# Altium schematic sheet MCU.SchDoc
size A4
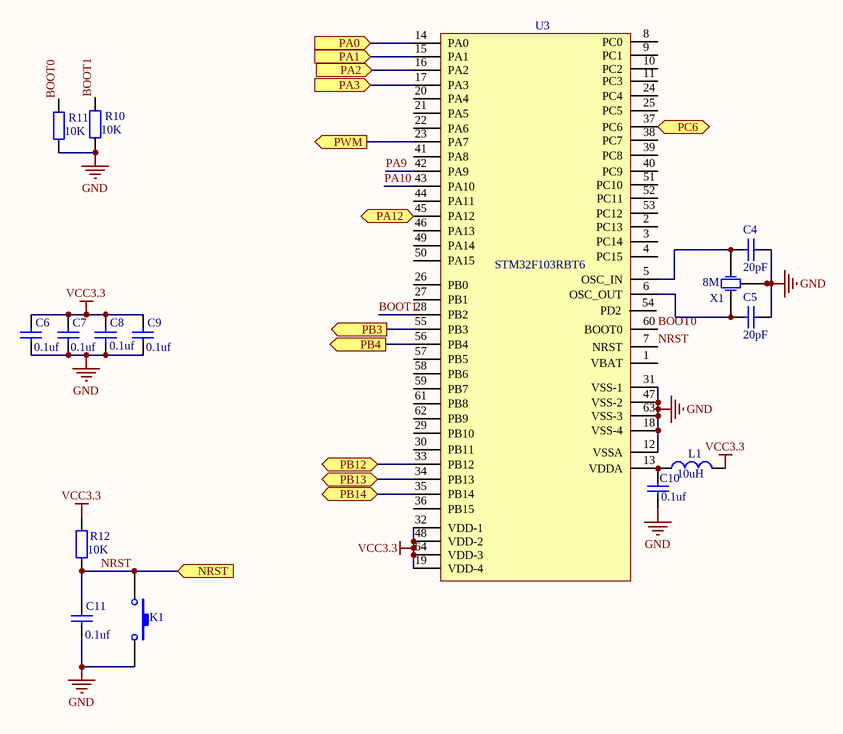
[diagram p0: MCU.SchDoc]

## Parts
C4  value 20pF  [0603]  (hidden comment: Capacitor-0805)
C5  value 20pF  [0603]  (hidden comment: Capacitor-0805)
C6  value 0.1uf  [0603]  (hidden comment: Capacitor-0603)
C7  value 0.1uf  [0603]  (hidden comment: Capacitor-0603)
C8  value 0.1uf  [0603]  (hidden comment: Capacitor-0603)
C9  value 0.1uf  [0603]  (hidden comment: Capacitor-0603)
C10  value 0.1uf  [0603]  (hidden comment: Capacitor-0603)
C11  value 0.1uf  [0603]  (hidden comment: Capacitor-0603)
K1  按键  [mini按键]  (value not drawn)
L1  value 10uH  [0805]  (hidden comment: Inductor)
R10  value 10K  [0603]  (hidden comment: Resistor-0603)
R11  value 10K  [0603]  (hidden comment: Resistor-0603)
R12  value 10K  [0603]  (hidden comment: Resistor-0603)
U3  STM32F103RBT6  [STM32F103RBT6]
X1  value 8M  [3225无源晶振]  (hidden comment: 3225无源晶振)

## Ports
NRST (in), PA0 (in), PA1 (in), PA2 (in), PA3 (in), PA12, PB3 (out), PB4 (out), PB12, PB13, PB14, PC6, PWM (out)

## Nets
GND: C4.1 C5.1 C6.1 C7.1 C8.1 C9.1 C10.1 C11.1 K1.2 R10.1 R11.1 U3.12(VSSA) U3.18(VSS-4) U3.31(VSS-1) U3.47(VSS-2) U3.63(VSS-3) X1.2(GND) X1.4(GND)
VCC3.3: C6.2 C7.2 C8.2 C9.2 L1.2 R12.2 U3.19(VDD-4) U3.32(VDD-1) U3.48(VDD-2) U3.64(VDD-3)
BOOT0: R11.2 U3.60(BOOT0)
BOOT1: R10.2 U3.28(PB2)
NRST: C11.2 K1.1 R12.1 U3.7(NRST) ; port NRST
PA0: U3.14(PA0) ; port PA0
PA1: U3.15(PA1) ; port PA1
PA2: U3.16(PA2) ; port PA2
PA3: U3.17(PA3) ; port PA3
PA9: U3.42(PA9)
PA10: U3.43(PA10)
PA12: U3.45(PA12) ; port PA12
PB3: U3.55(PB3) ; port PB3
PB4: U3.56(PB4) ; port PB4
PB12: U3.33(PB12) ; port PB12
PB13: U3.34(PB13) ; port PB13
PB14: U3.35(PB14) ; port PB14
PC6: U3.37(PC6) ; port PC6
PWM: U3.23(PA7) ; port PWM
NetC4_2: C4.2 U3.5(OSC_IN) X1.3(OSC2)
NetC5_2: C5.2 U3.6(OSC_OUT) X1.1(OSC1)
NetC10_2: C10.2 L1.1 U3.13(VDDA)

Not connected (* = marked no-connect by the designer): U3 1(VBAT) 2(PC13) 3(PC14) 4(PC15) 8(PC0) 9(PC1) 10(PC2) 11(PC3) 20(PA4) 21(PA5) 22(PA6) 24(PC4) 25(PC5) 26(PB0) 27(PB1) 29(PB10) 30(PB11) 36(PB15) 38(PC7) 39(PC8) 40(PC9) 41(PA8) 44(PA11) 46(PA13) 49(PA14) 50(PA15) 51(PC10) 52(PC11) 53(PC12) 54(PD2) 57(PB5) 58(PB6) 59(PB7) 61(PB8) 62(PB9)

## Library data of the parts
C4 C5 = Capacitor-0
U3 = STM32F103RBT6: Name: STM32F103RBT6